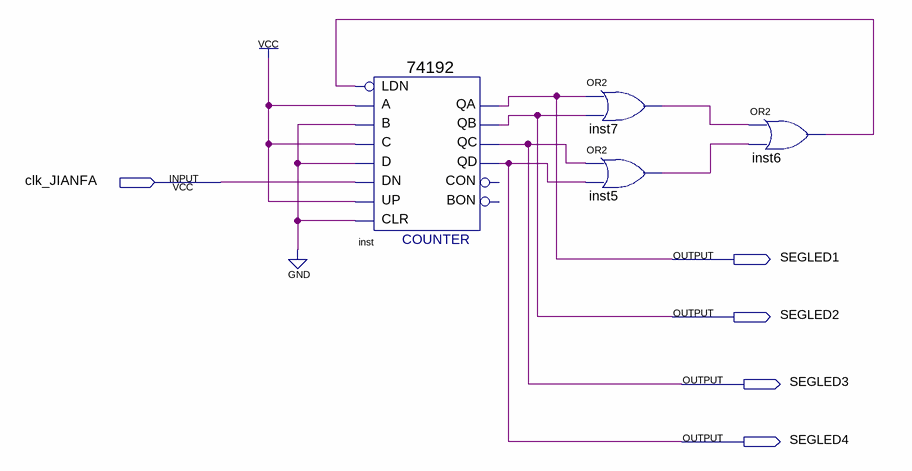
[diagram p0: schematic sheet]
// Quartus schematic jianfa.bdf as structural Verilog: 4 symbols, 5 pins
module jianfa (
  input  clk_JIANFA,
  output SEGLED1,
  output SEGLED2,
  output SEGLED3,
  output SEGLED4
);

  wire inst5_out, inst6_out, inst7_out;

  \74192  inst (
    .D(1'b0), .C(1'b1), .A(1'b1), .B(1'b0), .CLR(1'b0), .UP(1'b1), .DN(clk_JIANFA), .LDN(inst6_out),
    .QB(SEGLED2), .QA(SEGLED1), .QC(SEGLED3), .QD(SEGLED4));  // open: BON, CON
  or inst7 (inst7_out, SEGLED1, SEGLED2);
  or inst5 (inst5_out, SEGLED3, SEGLED4);
  or inst6 (inst6_out, inst7_out, inst5_out);
endmodule
